# Altium schematic sheet 2_MCU.schdoc
size 307 x 218 mm; Symbol: Artery_A4; Device: Artery_A4; @Project Name: AT-START-F422/F426; @Page Count: 4; @Create Date: 2025-04-14; Company: Artery Technology; Drawed: SD; Version: 1.0; Page Size: A4; @Update Date: 2025-04-14; @Page No: 2; @Schematic Name: AT-START-F426-V1.0; @Page Name: MCU; Title Block Position: 3; Width: 1170; Height: 825; Region Start: 1; X Region Count: 6; Y Region Count: 4; Blade Width: 10; @Board Name: AT-START-F426-V1.0; @Create Time: 11:42:27; @Update Time: 14:57:23
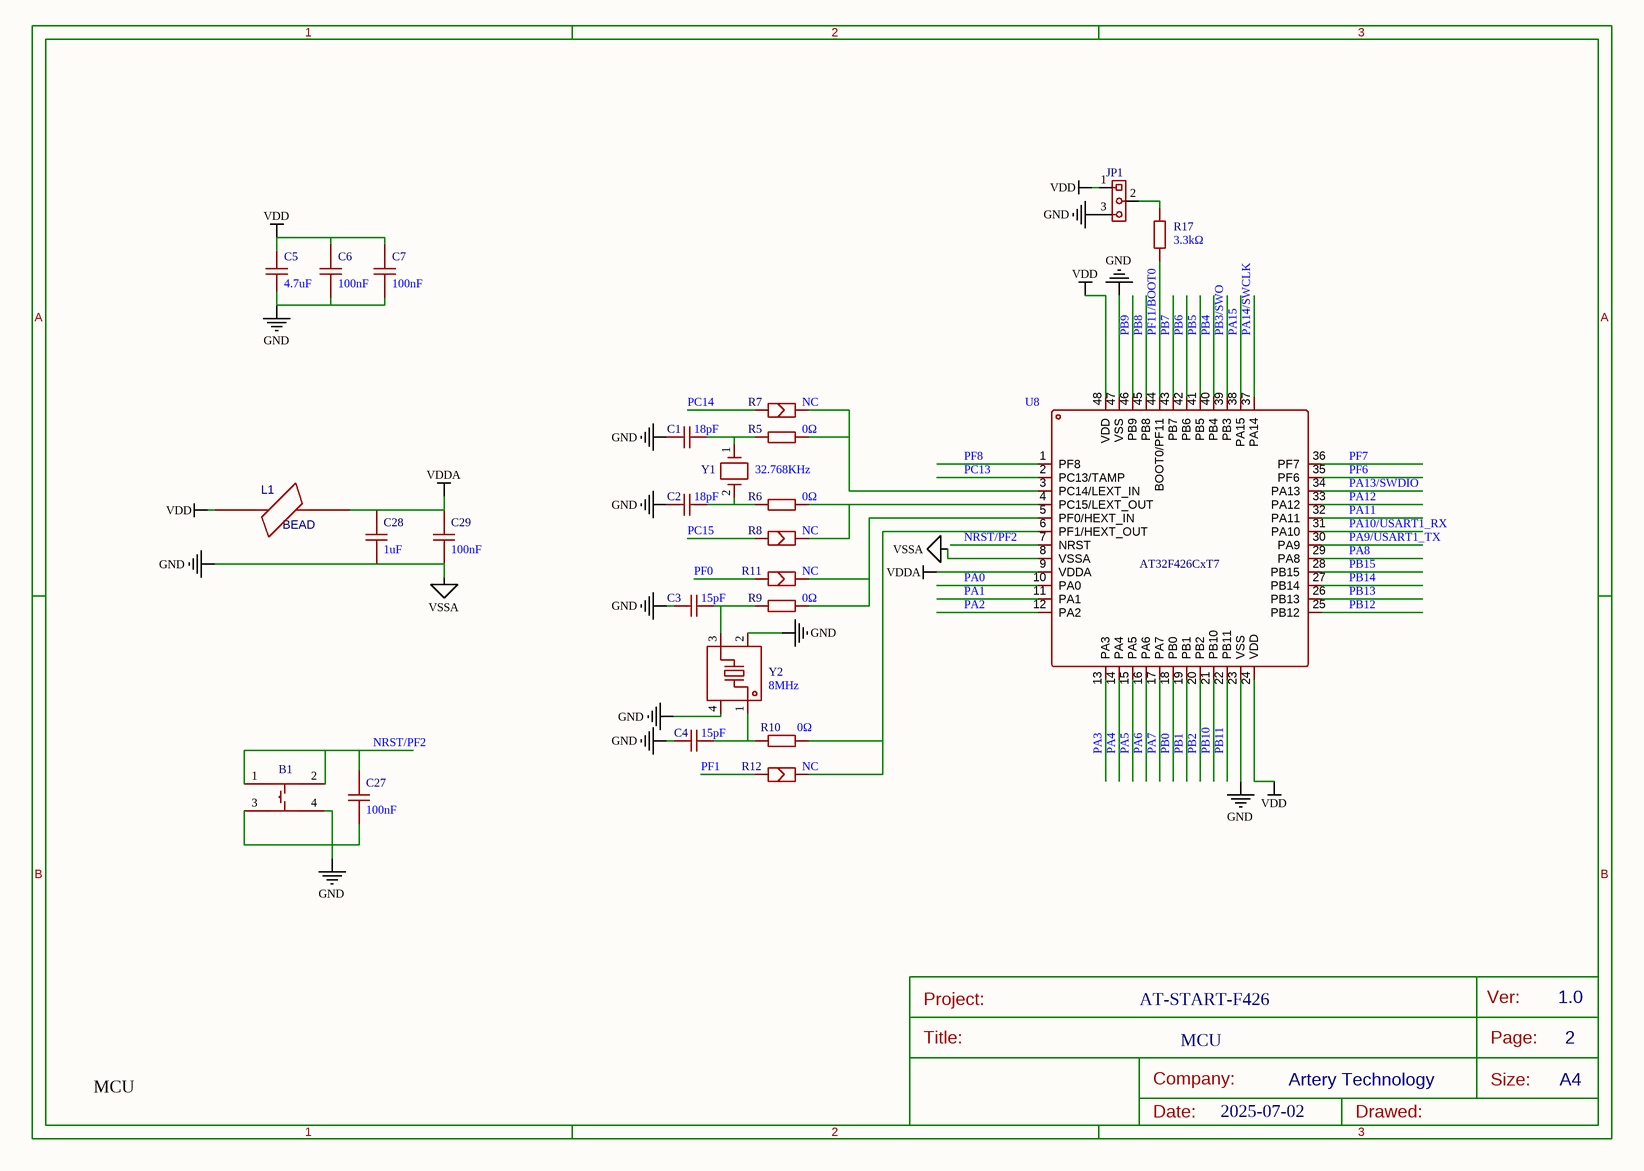
[diagram p0: 2_MCU.schdoc]

## Parts
B1  TS-1002S-05026C  [KEY-SMD_4P-L6.0-W6.0-P4.50-LS9.0]  (value not drawn)
C1  18pF  [C0603]
C2  18pF  [C0603]
C3  15pF  [C0603]
C4  15pF  [C0603]
C5  4.7uF  [C0603]
C6  100nF  [C0603]
C7  100nF  [C0603]
C27  100nF  [C0603]
C28  1uF  [C0603]
C29  100nF  [C0603]
JP1  2.54-1*3P针  [HDR-TH_3P-P2.54-V-M-1]  (value not drawn)
L1  BEAD  [r0603]
R5  0Ω  [SB-PAD_2]
R6  0Ω  [SB-PAD_2]
R7  NC  [SB-PAD_2]
R8  NC  [SB-PAD_2]
R9  0Ω  [SB-PAD_2]
R10  0Ω  [SB-PAD_2]
R11  NC  [SB-PAD_2]
R12  NC  [SB-PAD_2]
R17  3.3kΩ  [R0603]
U8  (no value)  [LQFP-48_L7.0-W7.0-P0.50-LS9.0-BL]
Y1  32.768KHz  [XTAL_SOP - FC-12M]
Y2  8MHz  [CRYSTAL-SMD_4P-L3.2-W2.5-BL]

## Nets
GND: B1.3 B1.4 C1.1 C2.1 C3.1 C4.1 C5.1 C6.1 C7.1 C27.1 C28.1 C29.1 JP1.3 U8.8(VSSA) U8.23(VSS) U8.47(VSS) Y2.2(GND) Y2.4(GND)  [also labelled VSSA]
VDD: C5.2 C6.2 C7.2 JP1.1 L1.1 U8.24(VDD) U8.48(VDD)
VDDA: C28.2 C29.2 L1.2 U8.9(VDDA)
NRST/PF2: B1.1 B1.2 C27.2 U8.7(NRST)
PA0: U8.10(PA0)
PA1: U8.11(PA1)
PA2: U8.12(PA2)
PA3: U8.13(PA3)
PA4: U8.14(PA4)
PA5: U8.15(PA5)
PA6: U8.16(PA6)
PA7: U8.17(PA7)
PA8: U8.29(PA8)
PA9/USART1_TX: U8.30(PA9)
PA10/USART1_RX: U8.31(PA10)
PA11: U8.32(PA11)
PA12: U8.33(PA12)
PA13/SWDIO: U8.34(PA13)
PA14/SWCLK: U8.37(PA14)
PA15: U8.38(PA15)
PB0: U8.18(PB0)
PB1: U8.19(PB1)
PB2: U8.20(PB2)
PB3/SWO: U8.39(PB3)
PB4: U8.40(PB4)
PB5: U8.41(PB5)
PB6: U8.42(PB6)
PB7: U8.43(PB7)
PB8: U8.45(PB8)
PB9: U8.46(PB9)
PB10: U8.21(PB10)
PB11: U8.22(PB11)
PB12: U8.25(PB12)
PB13: U8.26(PB13)
PB14: U8.27(PB14)
PB15: U8.28(PB15)
PC13: U8.2(PC13/TAMP)
PC14: R7.1
PC15: R8.1
PF0: R11.1
PF1: R12.1
PF6: U8.35(PF6)
PF7: U8.36(PF7)
PF8: U8.1(PF8)
PF11/BOOT0: R17.1 U8.44(BOOT0/PF11)
NetC1_2: C1.2 R5.1 Y1.1
NetC2_2: C2.2 R6.1 Y1.2
NetC3_2: C3.2 R9.1 Y2.3
NetC4_2: C4.2 R10.1 Y2.1
NetJP1_2: JP1.2 R17.2
NetR5_2: R5.2 R7.2 U8.3(PC14/LEXT_IN)
NetR6_2: R6.2 R8.2 U8.4(PC15/LEXT_OUT)
NetR9_2: R9.2 R11.2 U8.5(PF0/HEXT_IN)
NetR10_2: R10.2 R12.2 U8.6(PF1/HEXT_OUT)

## Notes on the sheet
- AT-START-F426
- MCU
- 2025-07-02
- 1
- 2
- 3
- A
- B
- Title:
- Project:
- Page:
- Ver:
- 1.0
- Date:
- Company:
- Drawed:
- Artery Technology
- Size:
- A4

## Library data of the parts
B1 = TS-1002S-05026C: Manufacturer: XUNPU(讯普); Add into BOM: yes; Circuit: 单刀单掷; Actuator Style: 圆形按钮; Switch Length: 6mm; Switch Height: 5mm; Contact Current: 50mA; Voltage Rating (DC): 12V; Origin Footprint: KEY_SOP_6*6; Symbol: TS-1002S-05026C; Device: TS-1002S-05026C; Supplier: LCSC; Supplier Part: C455110; Manufacturer Part: TS-1002S-05026C; JLCPCB Part Class: Extended Part; LCSC Part Name: 6*6*5mm 立贴 轻触开关; Supplier Footprint: SMD,6x6mm; Datasheet: https://atta.szlcsc.com/upload/public/pdf/source/20191118/C455126_F61E8FA1ED640FB1CE0B30B55DEB62E3.pdf; Convert to PCB: yes; Mounting Style: 立贴; Switch Width: 6mm; With Lamp: -; Mechanical Life: -; Design Item ID: Push_Bottom,Blue,SMD_2P; Library Name: *
C1 C2 = CL10C180JB8NNNC: Manufacturer: SAMSUNG(三星); Add into BOM: yes; Tolerance: ±5%; Voltage Rated: 50V; Temperature Coefficient: C0G; Symbol: CL10C180JB8NNNC; Device: CL10C180JB8NNNC; LCSC Part Name: 18pF ±5% 50V; Supplier Part: C1647; Manufacturer Part: CL10C180JB8NNNC; Supplier Footprint: 0603; JLCPCB Part Class: Basic Part; Datasheet: https://atta.szlcsc.com/upload/public/pdf/source/20160218/1457707763339.pdf; Supplier: LCSC; Convert to PCB: yes; Value: 18pF; Origin Footprint: C0603; Design Item ID: 10pF,50V,5%,SMD0603; Library Name: *
C3 C4 = CL10C150JB8NNNC: Manufacturer: SAMSUNG(三星); Add into BOM: yes; Tolerance: ±5%; Voltage Rated: 50V; Temperature Coefficient: C0G; Symbol: CL10C150JB8NNNC; Device: CL10C150JB8NNNC; LCSC Part Name: 15pF ±5% 50V; Supplier Part: C1644; Manufacturer Part: CL10C150JB8NNNC; Supplier Footprint: 0603; JLCPCB Part Class: Basic Part; Datasheet: https://atta.szlcsc.com/upload/public/pdf/source/20160218/1457707763339.pdf; Supplier: LCSC; Convert to PCB: yes; Value: 15pF; Origin Footprint: C0603; Design Item ID: 10pF,50V,5%,SMD0603; Library Name: *
C5 = CL10A475KO8NNNC: Manufacturer: SAMSUNG(三星); Add into BOM: yes; Tolerance: ±10%; Voltage Rated: 16V; Temperature Coefficient: X5R; Symbol: CL10A475KO8NNNC; Device: CL10A475KO8NNNC; Supplier: LCSC; Manufacturer Part: CL10A475KO8NNNC; Value: 4.7uF; Supplier Part: C19666; JLCPCB Part Class: Basic Part; LCSC Part Name: 4.7uF ±10% 16V; Supplier Footprint: 0603; Datasheet: https://atta.szlcsc.com/upload/public/pdf/source/20160218/1457707763339.pdf; Convert to PCB: yes; Origin Footprint: C0603; Design Item ID: 0.1uF,25V,20%,SMD0402; Library Name: *
C6 C7 C27-C29 = CC0603KRX7R9BB104: Manufacturer: YAGEO(国巨); Add into BOM: yes; Tolerance: ±10%; Voltage Rated: 50V; Temperature Coefficient: X7R; Symbol: CC0603KRX7R9BB104; Device: CC0603KRX7R9BB104; Supplier: LCSC; Manufacturer Part: CC0603KRX7R9BB104; JLCPCB Part Class: Basic Part; LCSC Part Name: 100nF ±10% 50V; Supplier Footprint: 0603; Datasheet: https://atta.szlcsc.com/upload/public/pdf/source/20180910/C282072_33301C7F631E79921B82A8DAC6BCC5B3.pdf; Convert to PCB: yes; Origin Footprint: C0603; Library Name: *
  C6 C7 C29: Value: 100nF; Supplier Part: C14663; Design Item ID: 0.1uF,25V,20%,SMD0402
  C27: Value: 100nF; Supplier Part: C14663; Design Item ID: 0.1uF,50V,20%,SMD0603
  C28: Value: 1uF; Design Item ID: 0.1uF,25V,20%,SMD0402
JP1 = 2.54-1*3P针: Manufacturer: BOOMELE(博穆精密); Symbol: Header-Male-2.54_1x3; Add into BOM: yes; Pin Structure: 1x3P; Pitch: 2.54mm; Circluar Pins/Square Pins: 方针; Current Rating (Max): 3A; Origin Footprint: HEADER 1X2; Device: 2.54-1*3P针; LCSC Part Name: 间距:2.54mm 1x3P 直插 方针; Supplier Part: C49257; Manufacturer Part: 2.54-1*3P针; Supplier Footprint: 插件,P=2.54mm; JLCPCB Part Class: Extended Part; Datasheet: https://atta.szlcsc.com/upload/public/pdf/source/20221018/3E9408392E35E6F57A28985E5F7BF5C9.pdf; Supplier: LCSC; Convert to PCB: yes; Row Spacing: -; Mounting Type: 直插; Number of Rows: 单排; Number of Pins: 3P; Voltage Rating (Max): -; Length of Mating Pin: -; Insulation Height: -; Length of End Connection Pin: -; Contact Material: -; Contact Plating: -; Operating Temperature Range: -40℃~+105℃; Color: 黑色
L1 = BEAD: Add into BOM: yes; Symbol: BEAD; Device: BEAD; Convert to PCB: yes; Origin Footprint: R0603; Design Item ID: BEAD; Library Name: *
R5 R6 R9 R10 = 0603WAF0000T5E: Manufacturer: UNI-ROYAL(厚声); Add into BOM: yes; Tolerance: ±1%; Power(Watts): 100mW; Overload Voltage (Max): 75V; Origin Footprint: SB-PAD; Symbol: 0603WAF0000T5E; Device: 0603WAF0000T5E; Supplier: LCSC; Manufacturer Part: 0603WAF0000T5E; Supplier Part: C21189; Value: 0Ω; JLCPCB Part Class: Basic Part; LCSC Part Name: 0Ω ±1% 100mW 厚膜电阻; Supplier Footprint: 0603; Datasheet: https://atta.szlcsc.com/upload/public/pdf/source/20200306/C422600_1E6D84923E4A46A82E41ADD87F860B5C.pdf; Convert to PCB: yes; Type: 厚膜电阻; Operating Temperature Range: -55℃~+155℃; Design Item ID: 0,1/10W,1%,SMD0603; Library Name: *
R7 R8 R11 R12 = SB_PAD: Symbol: SB-PAD; Convert to PCB: yes; Device: SB_PAD; Add into BOM: yes; Origin Footprint: SB-PAD; Design Item ID: 0,1/10W,1%,SMD0603; Library Name: *
R17 = 0603WAF3301T5E: Manufacturer: UNI-ROYAL(厚声); Symbol: 0603WAF1002T5E; Add into BOM: yes; Tolerance: ±1%; Power(Watts): 100mW; Overload Voltage (Max): 75V; Temperature Coefficient: ±100ppm/℃; Device: 0603WAF3301T5E; Supplier: LCSC; Manufacturer Part: 0603WAF3301T5E; Supplier Part: C22978; Value: 3.3kΩ; JLCPCB Part Class: Basic Part; LCSC Part Name: 3.3kΩ ±1% 100mW 厚膜电阻; Supplier Footprint: 0603; Datasheet: https://atta.szlcsc.com/upload/public/pdf/source/20200306/C422600_1E6D84923E4A46A82E41ADD87F860B5C.pdf; Convert to PCB: yes; Type: 厚膜电阻; Operating Temperature Range: -55℃~+155℃; Origin Footprint: R0603; Design Item ID: 10K,1/10W,1%,SMD0603; Library Name: *
U8 = AT32F426CxT7: Manufacturer: Artery Technology; Add into BOM: yes; Symbol: AT32F426CxT7; Device: AT32F426CxT7; Convert to PCB: yes
Y1 = 32.768KHz: Symbol: 32.768KHz,CRY,30PPM,Size_3X8; Add into BOM: yes; Device: 32.768KHz; Convert to PCB: yes; Origin Footprint: XTAL_SOP - FC-12M; Design Item ID: 32.768KHz,CRY,30PPM,Size_3X8; Library Name: *
Y2 = CJ13-080001210B20: Manufacturer: CJ(江苏长电/长晶); Add into BOM: yes; Normal temperature Frequency Tolerance: ±10ppm; External load capacitor: 12pF; Crystal Type: 贴片晶振; Frequency Stability(Full temperature range): ±30ppm; Equivalent Series Resistance (ESR): 100Ω; Origin Footprint: SMD_5032_4P; Symbol: CJ13-080001210B20; Device: CJ13-080001210B20; LCSC Part Name: 8MHz ±10ppm 12pF; Supplier Part: C2875274; Manufacturer Part: CJ13-080001210B20; Supplier Footprint: SMD3225-4P; JLCPCB Part Class: Extended Part; Datasheet: https://atta.szlcsc.com/upload/public/pdf/source/20210824/6E1F59D92CEEC2B7E10E0FA064B9C05B.pdf; Supplier: LCSC; Convert to PCB: yes; Value: 8MHz; Operating Temperature: -40℃~+85℃; Design Item ID: SMD-5032_4P  8MHZ 20PF 10PPM; Library Name: Artery_Wanbing; ComponentLink1Description: 供应商链接; ComponentLink1URL: http://www.szlcsc.com/product/details_9522.html; SuppliersPartNumber: C9002